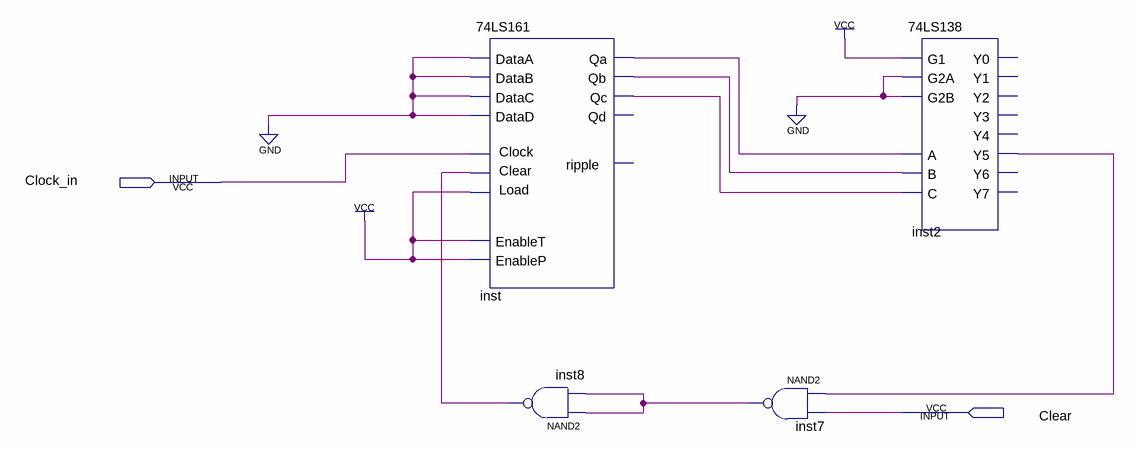
[diagram p0: schematic sheet]
// Quartus schematic Step_counter.bdf as structural Verilog: 4 symbols, 2 pins
module Step_counter (
  input  Clock_in,
  input  Clear
);

  wire inst2_y5, inst7_out, inst8_out, inst_qa, inst_qb, inst_qc;

  \74LS161  inst (
    .Clock(Clock_in), .DataA(1'b0), .Clear(inst8_out), .DataB(1'b0), .Load(1'b1), .EnableP(1'b1),
    .EnableT(1'b1), .DataC(1'b0), .DataD(1'b0), .Qa(inst_qa), .Qb(inst_qb), .Qc(inst_qc));  // open: Qd, ripple
  nand inst8 (inst8_out, inst7_out, inst7_out);
  nand inst7 (inst7_out, inst2_y5, Clear);
  \74LS138  inst2 (
    .G1(1'b1), .G2A(1'b0), .G2B(1'b0), .A(inst_qa), .B(inst_qb), .C(inst_qc), .Y5(inst2_y5));  // open: Y0, Y1, Y2, Y3, Y4, Y6, Y7
endmodule
